# Altium schematic sheet Schematic.SchDoc
size 294 x 208 mm; SheetNumber: 1; SheetTotal: 1
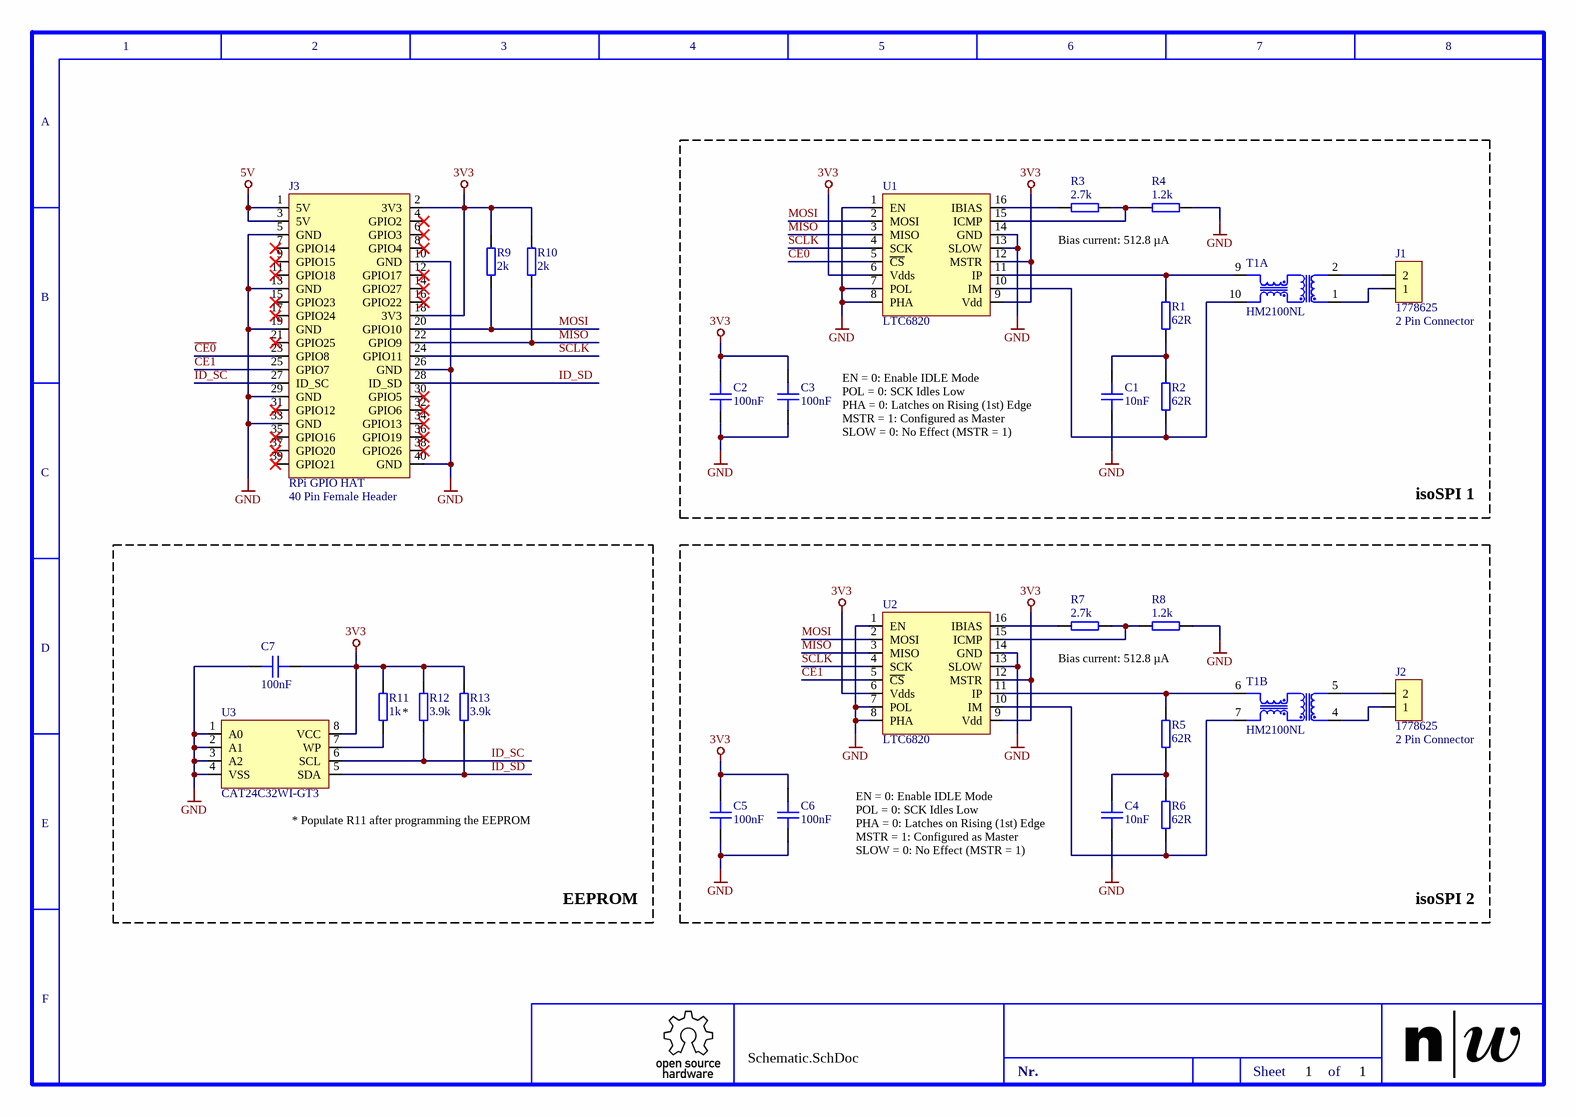
[diagram p0: Schematic.SchDoc]

## Parts
C1  10nF  [CAP 0603]
C2  100nF  [CAP 0603]
C3  100nF  [CAP 0603]
C4  10nF  [CAP 0603]
C5  100nF  [CAP 0603]
C6  100nF  [CAP 0603]
C7  100nF  [CAP 0603]
J1  1778625  [PTSM 0.5 2 HH THT]
J2  1778625  [PTSM 0.5 2 HH THT]
J3  RPi GPIO HAT  [Pin Header 2x20 THT 2.54 Female]
R1  62R  [0603]
R2  62R  [0603]
R3  2.7k  [0603]
R4  1.2k  [0603]
R5  62R  [0603]
R6  62R  [0603]
R7  2.7k  [0603]
R8  1.2k  [0603]
R9  2k  [0603]
R10  2k  [0603]
R11  1k  [0603]
R12  3.9k  [0603]
R13  3.9k  [0603]
T1  HM2100NL  [HM2100NL]  (parts A,B of 2)
U1  LTC6820  [MSOP-16]
U2  LTC6820  [MSOP-16]
U3  CAT24C32WI-GT3  [SO-8]

## Blocks framed on the sheet
isoSPI 1: C1-C3 J1 R1-R4 T1 U1
EEPROM: C7 R11-R13 U3
isoSPI 2: C4-C6 J2 R5-R8 T1 U2

## Nets
3V3: C2.2 C3.2 C5.2 C6.2 C7.1 J3.2(3V3) J3.18(3V3) R9.2 R10.2 R11.2 R12.2 R13.2 U1.6(Vdds) U1.9(Vdd) U1.12(MSTR) U2.6(Vdds) U2.9(Vdd) U2.12(MSTR) U3.8(VCC)
5V: J3.1(5V) J3.3(5V)
GND: C1.1 C2.1 C3.1 C4.1 C5.1 C6.1 C7.2 J3.5(GND) J3.10(GND) J3.13(GND) J3.19(GND) J3.26(GND) J3.29(GND) J3.33(GND) J3.40(GND) R4.2 R8.2 U1.1(EN) U1.7(POL) U1.8(PHA) U1.13(SLOW) U1.14(GND) U2.1(EN) U2.7(POL) U2.8(PHA) U2.13(SLOW) U2.14(GND) U3.1(A0) U3.2(A1) U3.3(A2) U3.4(VSS)
~{CE0}: J3.23(GPIO8) U1.5(~{CS})
~{CE1}: J3.25(GPIO7) U2.5(~{CS})
ID_SC: J3.27(ID_SC) R12.1 U3.6(SCL)
ID_SD: J3.28(ID_SD) R13.1 U3.5(SDA)
MISO: J3.22(GPIO9) R10.1 U1.3(MISO) U2.3(MISO)
MOSI: J3.20(GPIO10) R9.1 U1.2(MOSI) U2.2(MOSI)
SCLK: J3.24(GPIO11) U1.4(SCK) U2.4(SCK)
NetC1_2: C1.2 R1.1 R2.2
NetC4_2: C4.2 R5.1 R6.2
NetJ1_1: J1.1 T1.1
NetJ1_2: J1.2 T1.2
NetJ2_1: J2.1 T1.4
NetJ2_2: J2.2 T1.5
NetR1_2: R1.2 T1.9 U1.11(IP)
NetR2_1: R2.1 T1.10 U1.10(IM)
NetR3_1: R3.1 U1.16(IBIAS)
NetR3_2: R3.2 R4.1 U1.15(ICMP)
NetR5_2: R5.2 T1.6 U2.11(IP)
NetR6_1: R6.1 T1.7 U2.10(IM)
NetR7_1: R7.1 U2.16(IBIAS)
NetR7_2: R7.2 R8.1 U2.15(ICMP)
NetR11_1: R11.1 U3.7(WP)

Not connected (* = marked no-connect by the designer): J3 4(GPIO2)* 6(GPIO3)* 7(GPIO14)* 8(GPIO4)* 9(GPIO15)* 11(GPIO18)* 12(GPIO17)* 14(GPIO27)* 15(GPIO23)* 16(GPIO22)* 17(GPIO24)* 21(GPIO25)* 30(GPIO5)* 31(GPIO12)* 32(GPIO6)* 34(GPIO13)* 35(GPIO16)* 36(GPIO19)* 37(GPIO20)* 38(GPIO26)* 39(GPIO21)*

## Notes on the sheet
- Bias current: 512.8 µA
- EN = 0: Enable IDLE Mode
  POL = 0: SCK Idles Low
  PHA = 0: Latches on Rising (1st) Edge
  MSTR = 1: Configured as Master
  SLOW = 0: No Effect (MSTR = 1)
- *
- (near U3) * Populate R11 after programming the EEPROM
- 1
- 2
- 3
- 4
- 5
- 6
- 7
- 8
- A
- B
- C
- D
- E
- F
- Nr.
- Sheet
- of

## Library data of the parts
C1 C4 = 4: ID: 4; Value: 10nF; Mounting: SMT; Package: 0603
C2 C3 C5-C7 = 5: ID: 5; Value: 100nF; Mounting: SMT; Package: 0603
J1 J2 = 3: 2 Pin Connector; ID: 3; Desc: 2 Pin Connector; Supplier 1: Distrelec; Supplier Part Number 1: 148-41-887; Designation: 1778625
J3 = 6: 40 Pin Female Header; ID: 6; Descr: 40 Pin Female Header; Designation: RPi GPIO HAT
R1 R2 R5 R6 = 238: ID: 238; Tolerance: 1%; Power Rating: 0.1W; Value: 62R; Mounting: SMD; Type: Chip; Package: 0603
R3 R7 = 277: ID: 277; Tolerance: 1%; Power Rating: 0.1W; Value: 2.7k; Mounting: SMD; Type: Chip; Package: 0603
R4 R8 = 269: ID: 269; Tolerance: 1%; Power Rating: 0.1W; Value: 1.2k; Mounting: SMD; Type: Chip; Package: 0603
R9 R10 = 274: ID: 274; Tolerance: 1%; Power Rating: 0.1W; Value: 2k; Mounting: SMD; Type: Chip; Package: 0603
R11 = 267: ID: 267; Tolerance: 1%; Power Rating: 0.1W; Value: 1k; Mounting: SMD; Type: Chip; Package: 0603
R12 R13 = 281: ID: 281; Tolerance: 1%; Power Rating: 0.1W; Value: 3.9k; Mounting: SMD; Type: Chip; Package: 0603
T1 = 3: BMS Communication Transformer with Choke; ID: 3; Turns Ratio: 1:1; Insulation: 4.3kV; Primary Inductance: 300uH; Tolerance: 50%; DCR Primary: 850m; DCR Secondary: 450m; Device Height: 3.45mm; Mounting: SMT; Supplier 1: Digi-Key; Supplier Part Number 1: 1840-1032-1-ND; ComponentLink1Description: Datasheet; ComponentLink1URL: https://productfinder.pulseeng.com/doc_type/WEB301/doc_num/HM2100NL/doc_part/HM2100NL.pdf; Designation: HM2100NL
U1 U2 = 1: Isolated SPI Communications Interface; ID: 1; Mounting: SMT; Package: MSOP-16; Supplier 1: Digi-Key; Supplier Part Number 1: LTC6820HMS#TRPBFCT-ND; ComponentLink1Description: Datasheet; ComponentLink1URL: https://www.analog.com/media/en/technical-documentation/data-sheets/6820fb.pdf; Designation: LTC6820
U3 = 1: EEPROM Memory IC 32Kb; ID: 1; Mounting: SMT; Package: SO-8; Supplier 1: Digi-Key; Supplier Part Number 1: CAT24C32WI-GT3CT-ND; ComponentLink1Description: Datasheet; ComponentLink1URL: https://www.onsemi.com/pub/Collateral/CAT24C32-D.PDF; Designation: CAT24C32WI-GT3